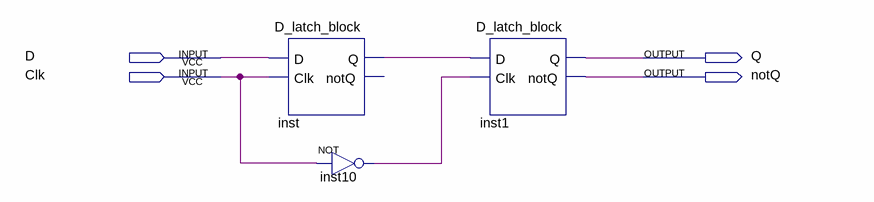
[diagram p0: schematic sheet]
// Quartus schematic Negative_MS_D_latch.bdf as structural Verilog: 3 symbols, 4 pins
module Negative_MS_D_latch (
  input  D,
  input  Clk,
  output Q,
  output notQ
);

  wire inst10_out, inst_q;

  D_latch_block inst (.D(D), .Clk(Clk), .Q(inst_q));  // open: notQ
  not inst10 (inst10_out, Clk);
  D_latch_block inst1 (.D(inst_q), .Clk(inst10_out), .Q(Q), .notQ(notQ));
endmodule
